# Altium project EDR.PrjPcb
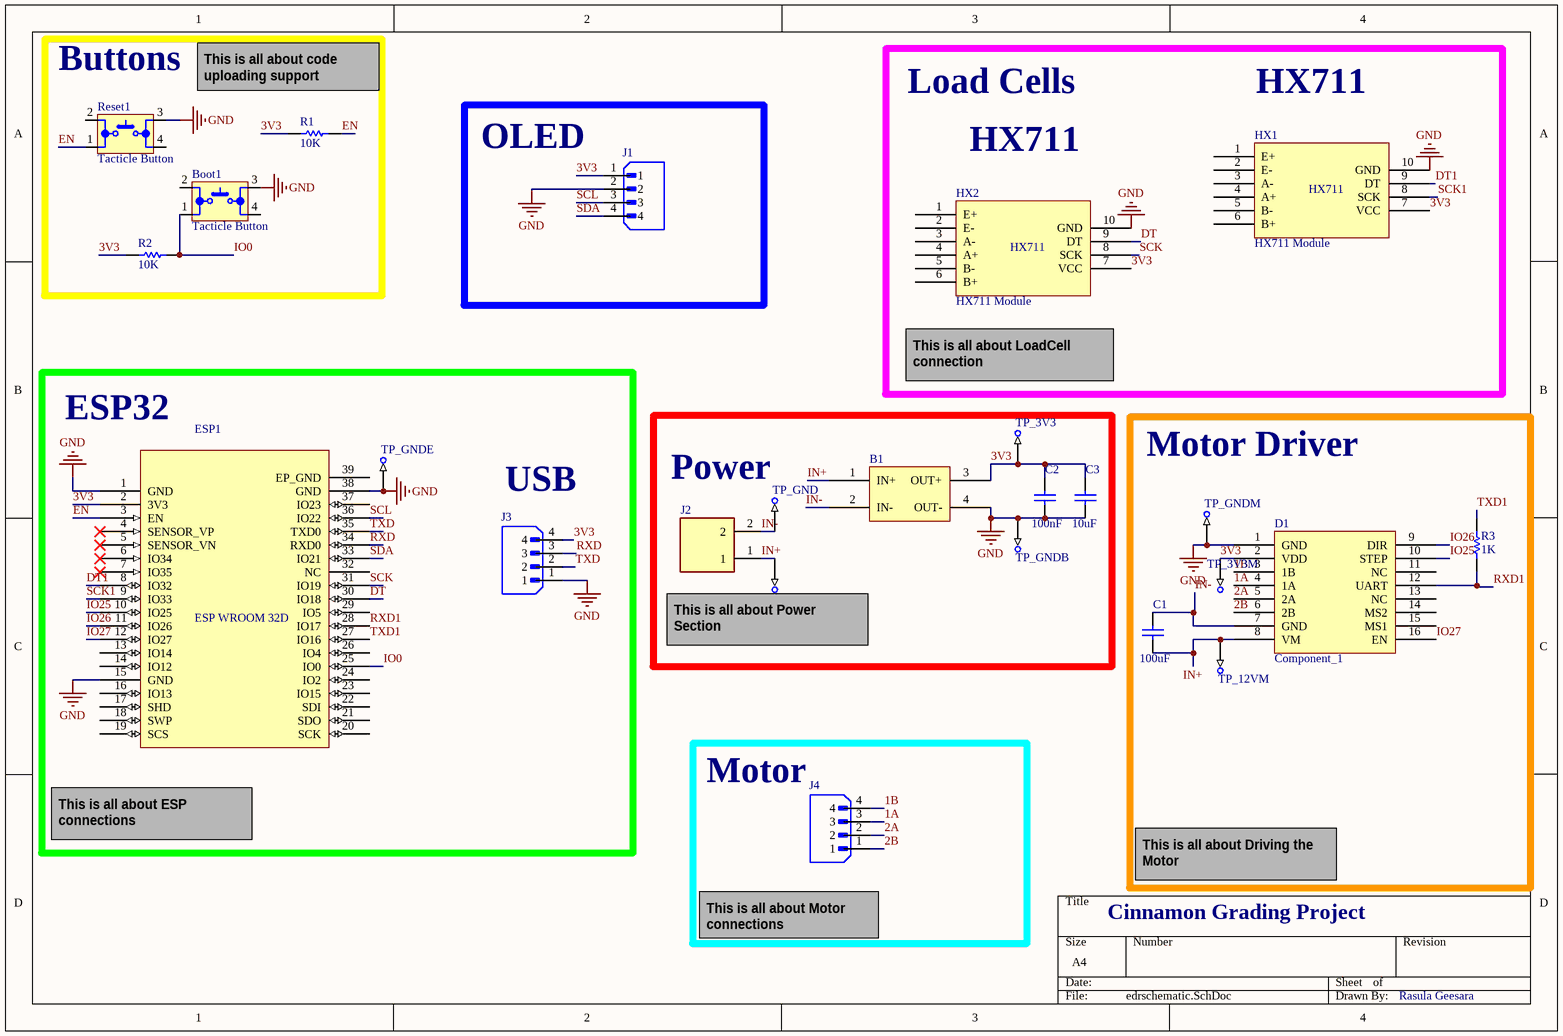
[diagram p0: edrschematic.SchDoc]
1 sheet, 25 parts. Net scope: global (net labels, ports and power ports of the same name join across sheets).
Board file: edrpcb.PcbDoc

## Sheet edrschematic.SchDoc
size A4; DrawnBy: Rasula Geesara; SheetNumber: 1; SheetTotal: 1

### Parts
B1  LM2596s Buck  [PCBComponent_1]  (value not drawn)
Boot1  Tacticle Button  [1825910-6_BUTTON]
C1  value 100uF  [RAD-0.3]  (hidden comment: Cap)
C2  value 100nF  [RAD-0.3]  (hidden comment: Cap)
C3  value 10uF  [RAD-0.3]  (hidden comment: Cap)
D1  Component_1  [MODULE_TMC2208_SILENTSTEPSTICK]
ESP1  Component_1  [ESP32-WROOM-32D]  (value not drawn)
HX1  HX711 Module  [HX711]
HX2  HX711 Module  [HX711]
J1  B4B-XH-A(LF)(SN)  [JST_B4B-XH-A(LF)(SN)]  (value not drawn)
J2  KF301-2P  [HANDSON_KF301-2P]  (value not drawn)
J3  B4B-XH-A(LF)(SN)  [JST_B4B-XH-A(LF)(SN)]  (value not drawn)
J4  B4B-XH-A(LF)(SN)  [JST_B4B-XH-A(LF)(SN)]  (value not drawn)
R1  value 10K  [AXIAL-0.3]  (hidden comment: Res1)
R2  value 10K  [AXIAL-0.3]  (hidden comment: Res1)
R3  value 1K  [AXIAL-0.3]  (hidden comment: Res1)
Reset1  Tacticle Button  [1825910-6_BUTTON]
TP_3V3  net?  [MY_Testpad1]  (value not drawn)  (no BOM)
TP_3V3M  net?  [MY_Testpad1]  (value not drawn)  (no BOM)
TP_12VM  net?  [MY_Testpad1]  (value not drawn)  (no BOM)
TP_BAT  net?  [MY_Testpad1]  (value not drawn)  (no BOM)
TP_GND  net?  [MY_Testpad1]  (value not drawn)  (no BOM)
TP_GNDB  net?  [MY_Testpad1]  (value not drawn)  (no BOM)
TP_GNDE  net?  [MY_Testpad1]  (value not drawn)  (no BOM)
TP_GNDM  net?  [MY_Testpad1]  (value not drawn)  (no BOM)

### Blocks framed on the sheet
Buttons: Boot1 R1 R2 Reset1
OLED: J1
Power: B1 C2 C3 J2 TP_3V3 TP_BAT TP_GND TP_GNDB
Motor Driver: C1 D1 R3 TP_3V3M TP_12VM TP_GNDM
Motor: J4

### Nets
GND: B1.4(OUT-) Boot1.3 C2.1 C3.1 D1.1(GND) ESP1.1(GND) ESP1.15(GND) ESP1.38(GND) HX1.10(GND) HX2.10(GND) J1.2 J3.1 Reset1.3 TP_GNDB.1 TP_GNDE.1 TP_GNDM.1
1A: D1.4(1A) J4.3
1B: D1.3(1B) J4.4
2A: D1.5(2A) J4.2
2B: D1.6(2B) J4.1
3V3: B1.3(OUT+) C2.2 C3.2 D1.2(VDD) ESP1.2(3V3) HX1.7(VCC) HX2.7(VCC) J1.1 J3.4 R1.1 R2.1 TP_3V3.1 TP_3V3M.1
DT: ESP1.30(IO18) HX2.9(DT)
DT1: ESP1.8(IO32) HX1.9(DT)
EN: ESP1.3(EN) R1.2 Reset1.1
IN+: B1.1(IN+) C1.1 D1.8(VM) J2.1 TP_12VM.1 TP_BAT.1
IN-: B1.2(IN-) C1.2 D1.7(GND) J2.2 TP_GND.1
IO0: Boot1.1 ESP1.25(IO0) R2.2
IO25: D1.10(STEP) ESP1.10(IO25)
IO26: D1.9(DIR) ESP1.11(IO26)
IO27: D1.16(EN) ESP1.12(IO27)
RXD: ESP1.34(RXD0) J3.3
RXD1: D1.12(UART) ESP1.28(IO17) R3.1
SCK: ESP1.31(IO19) HX2.8(SCK)
SCK1: ESP1.9(IO33) HX1.8(SCK)
SCL: ESP1.36(IO22) J1.3
SDA: ESP1.33(IO21) J1.4
TXD: ESP1.35(TXD0) J3.2
TXD1: ESP1.27(IO16) R3.2

Not connected (* = marked no-connect by the designer): Boot1 2 4; D1 11(NC) 13(NC) 14(MS2) 15(MS1); ESP1 4(SENSOR_VP)* 5(SENSOR_VN)* 6(IO34)* 7(IO35)* 13(IO14) 14(IO12) 16(IO13) 17(SHD) 18(SWP) 19(SCS) 20(SCK) 21(SDO) 22(SDI) 23(IO15) 24(IO2) 26(IO4) 29(IO5) 32(NC) 37(IO23) 39(EP_GND); HX1 1(E+) 2(E-) 3(A-) 4(A+) 5(B-) 6(B+); HX2 1(E+) 2(E-) 3(A-) 4(A+) 5(B-) 6(B+); Reset1 2 4

### Notes on the sheet
- This is all about code uploading support
- Load Cells
- HX711
- This is all about LoadCell connection
- (near ESP1) ESP32
- (near J3) USB
- (near TP_BAT) This is all about Power Section
- This is all about ESP connections
- Cinnamon Grading Project
- This is all about Driving the Motor
- (near J4) This is all about Motor connections
- (in symbol Component_1) ESP WROOM 32D

### Library data of the parts
B1 = LM2596s Buck: buck converter
Boot1 Reset1 = 1825910-6: SWITCH TACTILE SPST-NO 0.05A 24V; Manufacturer: TE Connectivity Alcoswitch; Actuator Material: PBT; Mechanical Life: 100000Cycles; Operating Force: 160gf; Throw Configuration: SPST; Illumination Type: Non-Illuminated,Illuminated; Switch Travel: 0.25mm; Switch Function: Off-Mom; Contact Current Rating: 50mA; Actuator Type: Standard; Contact Resistance: 100mR; Actuator Length: 0.055inch; Manufacturer Part Number: 1825910-6; RoHS: Yes; Category: Pushbutton Switches; Stock 1: 97530; Pricing 1: 1=0,10000, 10=0,10100, 25=0,09560, 100=0,08700, 250=0,08180, 500=0,07484, 1000=0,06265, 2500=0,06092, 5000=0,05743 (USD); Mount: Through Hole; Contact Material: Copper Alloy; Contact Plating: Silver; Min Operating Temperature: -35°C; Max Operating Temperature: 85°C; Termination: PC Pins; Package Quantity: 750; Packaging: Loose Piece; Orientation: Straight; Max Voltage Rating (DC): 24V; Electrical Life: 100000Cycles; Max Current Rating: 50mA; Type: Switch; Length: 5.99mm; REACH SVHC: Unknown; ELV: Compliant; Lead Free: Lead Free; ComponentLink1URL: https://datasheet.ciiva.com/30199/1825910-6rqpn1825910-6-30199520.pdf?src-supplier=Onlinecomponents.com; ComponentLink1Description: https://datasheet.ciiva.com/30199/1825910-6rqpn1825910-6-30199520.pdf?src-supplier=Onlinecomponents.com; ComponentLink2URL: https://datasheet.ciiva.com/15184/getdatasheetpartid-395915-15184509.pdf?src-supplier=Verical; ComponentLink2Description: https://datasheet.ciiva.com/15184/getdatasheetpartid-395915-15184509.pdf?src-supplier=Verical; Supplier 1: Digi-Key; Supplier Part Number 1: 450-1650-ND
C1-C3 = Cap: Capacitor; Published: 8-Jun-2000; LatestRevisionDate: 17-Jul-2002; LatestRevisionNote: Re-released for DXP Platform.; PackageReference: RAD-0.3; Publisher: Altium Limited; PackageDescription: Radial Cap, Thru-Hole; 2 Leads; 0.3 in Pin Spacing
HX1 HX2 = HX711
J1 J3 J4 = B4B-XH-A(LF)(SN): Connector Header Through Hole 4 position 0.098 (2.50mm); MF: JST Sales; SnapEDA_Link: https://www.snapeda.com/parts/B4B-XH-A(LF)(SN)/JST+Sales+America+Inc./view-part/?ref=snap; Package: None; Value: *; MP: B4B-XH-A(LF)(SN); Check_prices: https://www.snapeda.com/parts/B4B-XH-A(LF)(SN)/JST+Sales+America+Inc./view-part/?ref=eda
J2 = KF301-2P: 2 Pin Terminal Block 5mm Pitch; MF: Handson Technology; SnapEDA_Link: https://www.snapeda.com/parts/KF301-2P/Handson+Technology/view-part/?ref=snap; Package: None; Value: *; MP: KF301-2P; Check_prices: https://www.snapeda.com/parts/KF301-2P/Handson+Technology/view-part/?ref=eda
R1-R3 = Res1: Resistor; Published: 8-Jun-2000; LatestRevisionDate: 17-Jul-2002; LatestRevisionNote: Re-released for DXP Platform.; PackageReference: AXIAL-0.3; Publisher: Altium Limited; PackageDescription: Axial Device, Thru-Hole; 2 Leads; 0.3 in Pin Spacing
TP_3V3 TP_3V3M TP_12VM TP_BAT TP_GND TP_GNDB TP_GNDE TP_GNDM = Test Point: ASiD Part Number: Test Point-AS